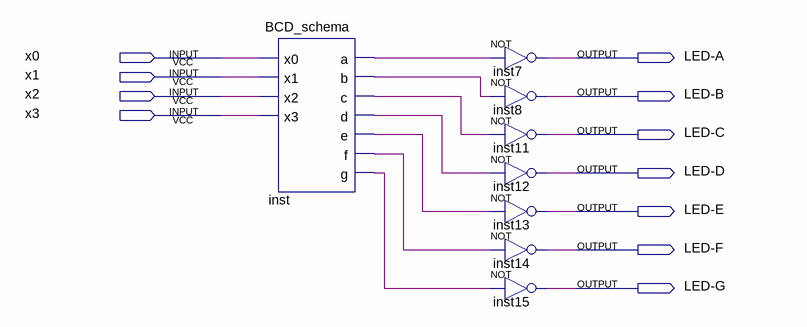
[diagram p0: schematic sheet]
// Quartus schematic BCD_led.bdf as structural Verilog: 8 symbols, 11 pins
module BCD_led (
  input  x0,
  input  x1,
  input  x2,
  input  x3,
  output \LED-A ,
  output \LED-B ,
  output \LED-C ,
  output \LED-D ,
  output \LED-E ,
  output \LED-F ,
  output \LED-G 
);

  wire inst_a, inst_b, inst_c, inst_d, inst_e, inst_f, inst_g;

  BCD_schema inst (
    .x0(x0), .x1(x1), .x2(x2), .x3(x3), .a(inst_a), .b(inst_b), .c(inst_c), .d(inst_d), .e(inst_e),
    .f(inst_f), .g(inst_g));
  not inst7 (\LED-A , inst_a);
  not inst8 (\LED-B , inst_b);
  not inst11 (\LED-C , inst_c);
  not inst12 (\LED-D , inst_d);
  not inst13 (\LED-E , inst_e);
  not inst14 (\LED-F , inst_f);
  not inst15 (\LED-G , inst_g);
endmodule
